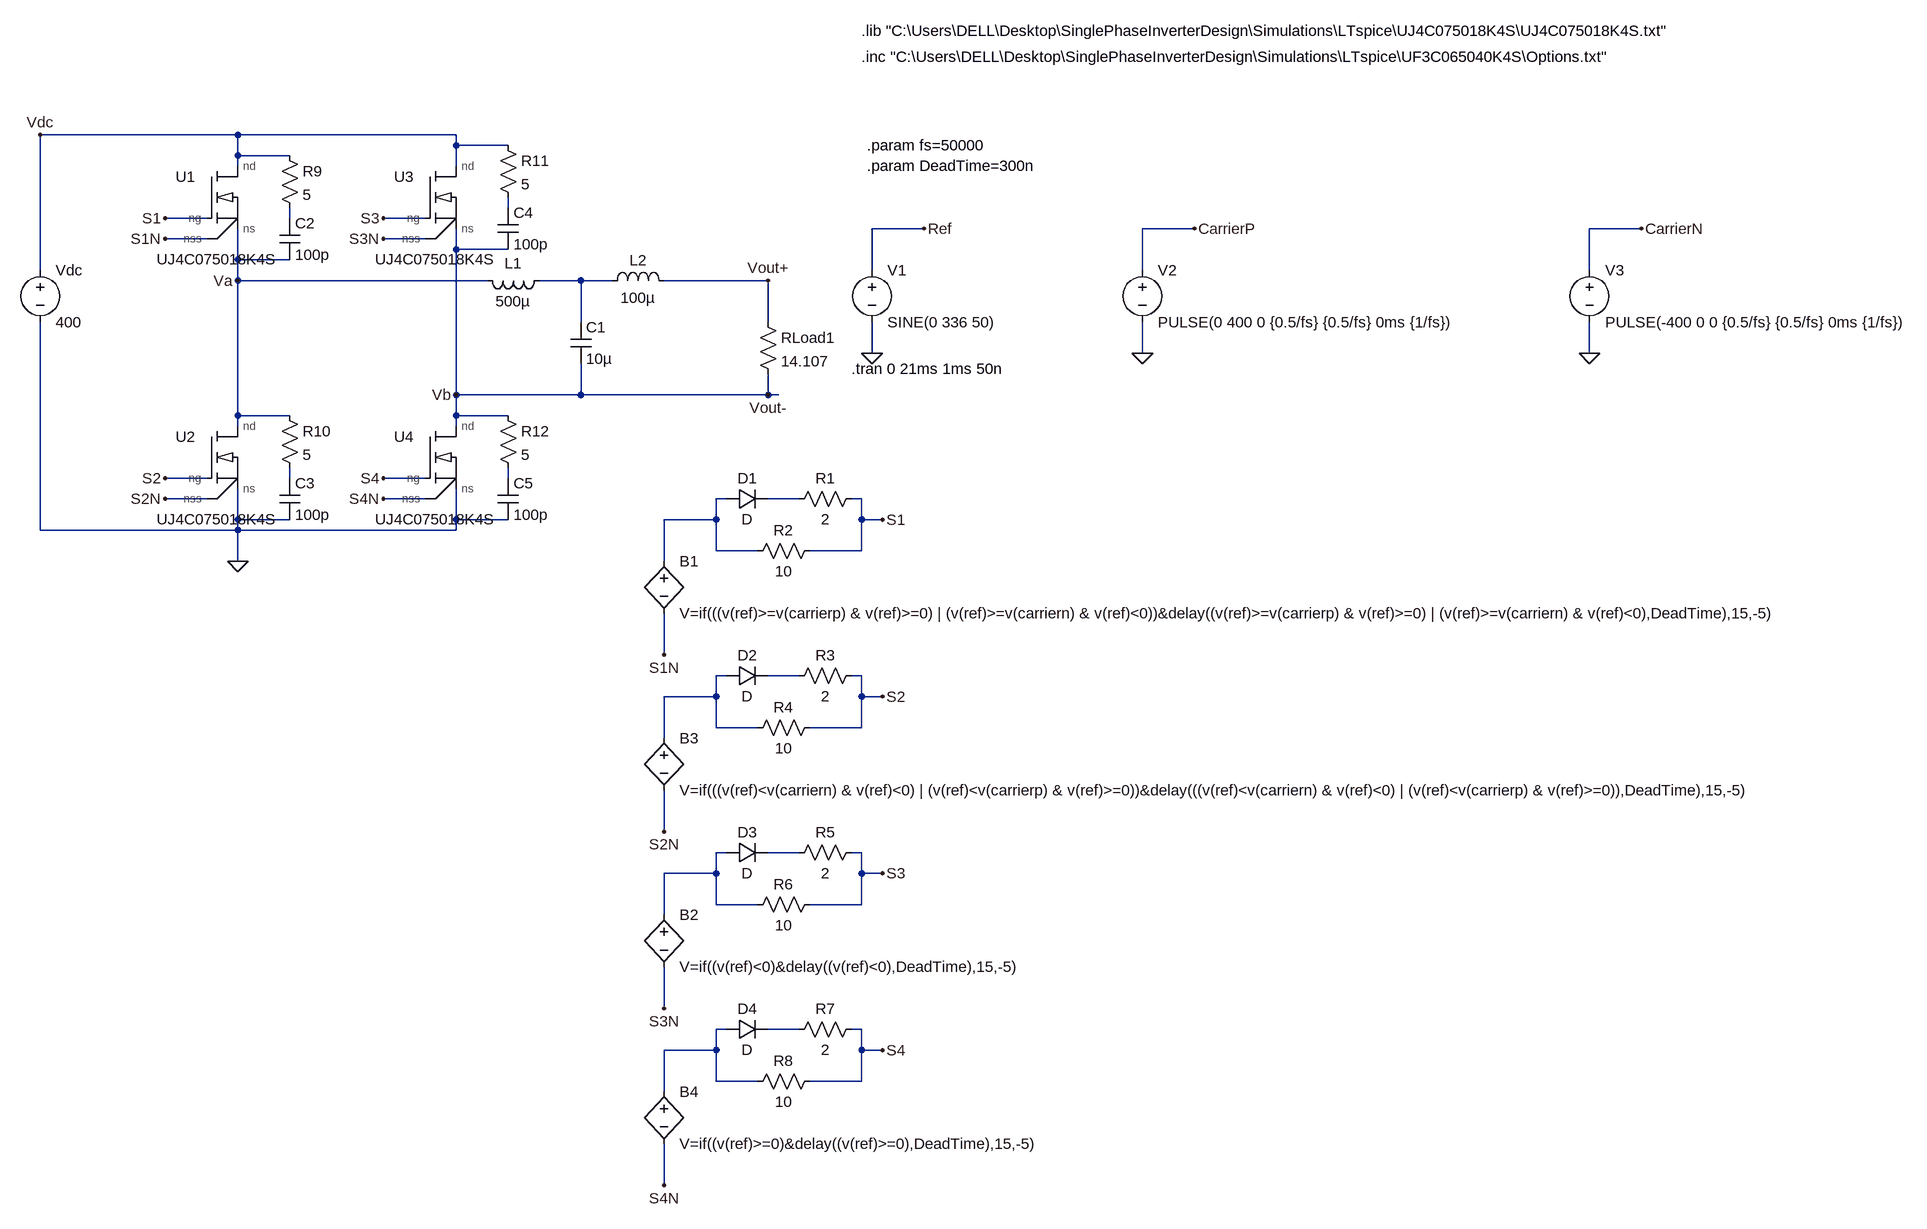
[diagram p0: schematic ModifiedUnipolar_UJ4C075018K4S_DeadTimeLeg.asc]
ModifiedUnipolar_UJ4C075018K4S_DeadTimeLeg.asc, the LTspice schematic file:
Version 4
SHEET 1 2032 1212
WIRE -800 -496 -1104 -496
WIRE -464 -496 -800 -496
WIRE -464 -480 -464 -496
WIRE -384 -480 -464 -480
WIRE -800 -464 -800 -496
WIRE -720 -464 -800 -464
WIRE -800 -448 -800 -464
WIRE -464 -448 -464 -480
WIRE -384 -384 -384 -400
WIRE -848 -368 -912 -368
WIRE -720 -368 -720 -384
WIRE -512 -368 -576 -368
WIRE 256 -352 176 -352
WIRE 672 -352 592 -352
WIRE 1360 -352 1280 -352
WIRE -848 -336 -912 -336
WIRE -512 -336 -576 -336
WIRE -464 -320 -464 -352
WIRE -384 -320 -464 -320
WIRE -800 -304 -800 -352
WIRE -720 -304 -800 -304
WIRE -1104 -288 -1104 -496
WIRE 176 -288 176 -352
WIRE 592 -288 592 -352
WIRE 1280 -288 1280 -352
WIRE -800 -272 -800 -304
WIRE -416 -272 -800 -272
WIRE -272 -272 -336 -272
WIRE -224 -272 -272 -272
WIRE 16 -272 -144 -272
WIRE -272 -208 -272 -272
WIRE 16 -208 16 -272
WIRE 176 -160 176 -208
WIRE 592 -160 592 -208
WIRE 1280 -160 1280 -208
WIRE -464 -96 -464 -320
WIRE -272 -96 -272 -144
WIRE -272 -96 -464 -96
WIRE 16 -96 16 -128
WIRE 16 -96 -272 -96
WIRE 32 -96 16 -96
WIRE -800 -64 -800 -272
WIRE -720 -64 -800 -64
WIRE -464 -64 -464 -96
WIRE -384 -64 -464 -64
WIRE -800 -48 -800 -64
WIRE -464 -48 -464 -64
WIRE -848 32 -912 32
WIRE -720 32 -720 16
WIRE -512 32 -576 32
WIRE -384 32 -384 16
WIRE -848 64 -912 64
WIRE -512 64 -576 64
WIRE -48 64 -64 64
WIRE 64 64 16 64
WIRE 160 64 144 64
WIRE -800 96 -800 48
WIRE -720 96 -800 96
WIRE -464 96 -464 48
WIRE -384 96 -464 96
WIRE -64 96 -64 64
WIRE -64 96 -144 96
WIRE 160 96 160 64
WIRE 192 96 160 96
WIRE -1104 112 -1104 -208
WIRE -800 112 -800 96
WIRE -800 112 -1104 112
WIRE -464 112 -464 96
WIRE -464 112 -800 112
WIRE -64 144 -64 96
WIRE 0 144 -64 144
WIRE 160 144 160 96
WIRE 160 144 80 144
WIRE -800 160 -800 112
WIRE -144 160 -144 96
WIRE -144 304 -144 240
WIRE -48 336 -64 336
WIRE 64 336 16 336
WIRE 160 336 144 336
WIRE -64 368 -64 336
WIRE -64 368 -144 368
WIRE 160 368 160 336
WIRE 192 368 160 368
WIRE -64 416 -64 368
WIRE 0 416 -64 416
WIRE 160 416 160 368
WIRE 160 416 80 416
WIRE -144 432 -144 368
WIRE -144 576 -144 512
WIRE -48 608 -64 608
WIRE 64 608 16 608
WIRE 160 608 144 608
WIRE -64 640 -64 608
WIRE -64 640 -144 640
WIRE 160 640 160 608
WIRE 192 640 160 640
WIRE -64 688 -64 640
WIRE 0 688 -64 688
WIRE 160 688 160 640
WIRE 160 688 80 688
WIRE -144 704 -144 640
WIRE -144 848 -144 784
WIRE -48 880 -64 880
WIRE 64 880 16 880
WIRE 160 880 144 880
WIRE -64 912 -64 880
WIRE -64 912 -144 912
WIRE 160 912 160 880
WIRE 192 912 160 912
WIRE -64 960 -64 912
WIRE 0 960 -64 960
WIRE 160 960 160 912
WIRE 160 960 80 960
WIRE -144 976 -144 912
WIRE -144 1120 -144 1056
FLAG 176 -160 0
FLAG 256 -352 Ref
FLAG 592 -160 0
FLAG 672 -352 CarrierP
FLAG -800 160 0
FLAG 1280 -160 0
FLAG 1360 -352 CarrierN
FLAG 192 96 S1
FLAG 192 368 S2
FLAG 192 640 S3
FLAG 192 912 S4
FLAG -144 304 S1N
FLAG -144 576 S2N
FLAG -144 848 S3N
FLAG -144 1120 S4N
FLAG -912 -368 S1
FLAG -912 32 S2
FLAG -912 -336 S1N
FLAG -912 64 S2N
FLAG -576 -368 S3
FLAG -576 -336 S3N
FLAG -576 32 S4
FLAG -576 64 S4N
FLAG -1104 -496 Vdc
FLAG -800 -272 Va
FLAG -464 -96 Vb
FLAG 16 -272 Vout+
FLAG 16 -96 Vout-
SYMBOL voltage 176 -304 R0
WINDOW 123 0 0 Left 0
WINDOW 39 0 0 Left 0
SYMATTR InstName V1
SYMATTR Value SINE(0 336 50)
SYMBOL voltage 592 -304 R0
WINDOW 123 0 0 Left 0
WINDOW 39 0 0 Left 0
SYMATTR InstName V2
SYMATTR Value PULSE(0 400 0 {0.5/fs} {0.5/fs} 0ms {1/fs})
SYMBOL bv -144 144 R0
SYMATTR InstName B1
SYMATTR Value V=if(((v(ref)>=v(carrierp) & v(ref)>=0) | (v(ref)>=v(carriern) & v(ref)<0))&delay((v(ref)>=v(carrierp) & v(ref)>=0) | (v(ref)>=v(carriern) & v(ref)<0),DeadTime),15,-5)
SYMBOL bv -144 688 R0
SYMATTR InstName B2
SYMATTR Value V=if((v(ref)<0)&delay((v(ref)<0),DeadTime),15,-5)
SYMBOL voltage -1104 -304 R0
WINDOW 123 0 0 Left 0
WINDOW 39 0 0 Left 0
SYMATTR InstName Vdc
SYMATTR Value 400
SYMBOL bv -144 416 R0
SYMATTR InstName B3
SYMATTR Value V=if(((v(ref)<v(carriern) & v(ref)<0) | (v(ref)<v(carrierp) & v(ref)>=0))&delay(((v(ref)<v(carriern) & v(ref)<0) | (v(ref)<v(carrierp) & v(ref)>=0)),DeadTime),15,-5)
SYMBOL bv -144 960 R0
SYMATTR InstName B4
SYMATTR Value V=if((v(ref)>=0)&delay((v(ref)>=0),DeadTime),15,-5)
SYMBOL voltage 1280 -304 R0
WINDOW 123 0 0 Left 0
WINDOW 39 0 0 Left 0
SYMATTR InstName V3
SYMATTR Value PULSE(-400 0 0 {0.5/fs} {0.5/fs} 0ms {1/fs})
SYMBOL res 160 48 R90
WINDOW 0 0 56 VBottom 2
WINDOW 3 32 56 VTop 2
SYMATTR InstName R1
SYMATTR Value 2
SYMBOL diode -48 80 R270
WINDOW 0 32 32 VTop 2
WINDOW 3 0 32 VBottom 2
SYMATTR InstName D1
SYMBOL res 96 128 R90
WINDOW 0 0 56 VBottom 2
WINDOW 3 32 56 VTop 2
SYMATTR InstName R2
SYMATTR Value 10
SYMBOL res 160 320 R90
WINDOW 0 0 56 VBottom 2
WINDOW 3 32 56 VTop 2
SYMATTR InstName R3
SYMATTR Value 2
SYMBOL diode -48 352 R270
WINDOW 0 32 32 VTop 2
WINDOW 3 0 32 VBottom 2
SYMATTR InstName D2
SYMBOL res 96 400 R90
WINDOW 0 0 56 VBottom 2
WINDOW 3 32 56 VTop 2
SYMATTR InstName R4
SYMATTR Value 10
SYMBOL res 160 592 R90
WINDOW 0 0 56 VBottom 2
WINDOW 3 32 56 VTop 2
SYMATTR InstName R5
SYMATTR Value 2
SYMBOL diode -48 624 R270
WINDOW 0 32 32 VTop 2
WINDOW 3 0 32 VBottom 2
SYMATTR InstName D3
SYMBOL res 96 672 R90
WINDOW 0 0 56 VBottom 2
WINDOW 3 32 56 VTop 2
SYMATTR InstName R6
SYMATTR Value 10
SYMBOL res 160 864 R90
WINDOW 0 0 56 VBottom 2
WINDOW 3 32 56 VTop 2
SYMATTR InstName R7
SYMATTR Value 2
SYMBOL diode -48 896 R270
WINDOW 0 32 32 VTop 2
WINDOW 3 0 32 VBottom 2
SYMATTR InstName D4
SYMBOL res 96 944 R90
WINDOW 0 0 56 VBottom 2
WINDOW 3 32 56 VTop 2
SYMATTR InstName R8
SYMATTR Value 10
SYMBOL UF3C065040K4S -832 -400 R0
SYMATTR InstName U1
SYMATTR Value UJ4C075018K4S
SYMBOL UF3C065040K4S -832 0 R0
SYMATTR InstName U2
SYMATTR Value UJ4C075018K4S
SYMBOL UF3C065040K4S -496 -400 R0
SYMATTR InstName U3
SYMATTR Value UJ4C075018K4S
SYMBOL UF3C065040K4S -496 0 R0
SYMATTR InstName U4
SYMATTR Value UJ4C075018K4S
SYMBOL ind -320 -288 R90
WINDOW 0 5 56 VBottom 2
WINDOW 3 32 56 VTop 2
SYMATTR InstName L1
SYMATTR Value 500µ
SYMATTR SpiceLine Rser=30m
SYMBOL res 0 -224 R0
SYMATTR InstName RLoad1
SYMATTR Value 14.107
SYMBOL cap -288 -208 R0
SYMATTR InstName C1
SYMATTR Value 10µ
SYMATTR SpiceLine Rser=0.1m
SYMBOL ind -240 -256 R270
WINDOW 0 32 56 VTop 2
WINDOW 3 5 56 VBottom 2
SYMATTR InstName L2
SYMATTR Value 100µ
SYMBOL res -736 -480 R0
SYMATTR InstName R9
SYMATTR Value 5
SYMBOL cap -736 -368 R0
SYMATTR InstName C2
SYMATTR Value 100p
SYMBOL res -736 -80 R0
SYMATTR InstName R10
SYMATTR Value 5
SYMBOL cap -736 32 R0
SYMATTR InstName C3
SYMATTR Value 100p
SYMBOL res -400 -496 R0
SYMATTR InstName R11
SYMATTR Value 5
SYMBOL cap -400 -384 R0
SYMATTR InstName C4
SYMATTR Value 100p
SYMBOL res -400 -80 R0
SYMATTR InstName R12
SYMATTR Value 5
SYMBOL cap -400 32 R0
SYMATTR InstName C5
SYMATTR Value 100p
TEXT 144 -136 Left 2 !.tran 0 21ms 1ms 50n
TEXT 168 -480 Left 2 !.param fs=50000\n.param DeadTime=300n
TEXT 160 -616 Left 2 !.inc "C:\\Users\\DELL\\Desktop\\SinglePhaseInverterDesign\\Simulations\\LTspice\\UF3C065040K4S\\Options.txt"
TEXT 160 -656 Left 2 !.lib "C:\\Users\\DELL\\Desktop\\SinglePhaseInverterDesign\\Simulations\\LTspice\\UJ4C075018K4S\\UJ4C075018K4S.txt"

The netlist it stands for:
* ModifiedUnipolar_UJ4C075018K4S_DeadTimeLeg.asc
V1 Ref 0 SINE(0 336 50)
V2 CarrierP 0 PULSE(0 400 0 {0.5/fs} {0.5/fs} 0ms {1/fs})
B1 N006 S1N V=if(((v(ref)>=v(carrierp) & v(ref)>=0) | (v(ref)>=v(carriern) & v(ref)<0))&delay((v(ref)>=v(carrierp) & v(ref)>=0) | (v(ref)>=v(carriern) & v(ref)<0),DeadTime),15,-5)
B2 N010 S3N V=if((v(ref)<0)&delay((v(ref)<0),DeadTime),15,-5)
Vdc Vdc 0 400
B3 N008 S2N V=if(((v(ref)<v(carriern) & v(ref)<0) | (v(ref)<v(carrierp) & v(ref)>=0))&delay(((v(ref)<v(carriern) & v(ref)<0) | (v(ref)<v(carrierp) & v(ref)>=0)),DeadTime),15,-5)
B4 N012 S4N V=if((v(ref)>=0)&delay((v(ref)>=0),DeadTime),15,-5)
V3 CarrierN 0 PULSE(-400 0 0 {0.5/fs} {0.5/fs} 0ms {1/fs})
R1 S1 N007 2
D1 N006 N007 D
R2 S1 N006 10
R3 S2 N009 2
D2 N008 N009 D
R4 S2 N008 10
R5 S3 N011 2
D3 N010 N011 D
R6 S3 N010 10
R7 S4 N013 2
D4 N012 N013 D
R8 S4 N012 10
XU1 Vdc S1 Va S1N UJ4C075018K4S  ; pins nd ng ns nss
XU2 Va S2 0 S2N UJ4C075018K4S  ; pins nd ng ns nss
XU3 Vdc S3 Vout- S3N UJ4C075018K4S  ; pins nd ng ns nss
XU4 Vout- S4 0 S4N UJ4C075018K4S  ; pins nd ng ns nss
L1 N003 Va 500µ Rser=30m
RLoad1 Vout+ Vout- 14.107
C1 N003 Vout- 10µ Rser=0.1m
L2 N003 Vout+ 100µ
R9 Vdc N002 5
C2 N002 Va 100p
R10 Va N004 5
C3 N004 0 100p
R11 Vdc N001 5
C4 N001 Vout- 100p
R12 Vout- N005 5
C5 N005 0 100p
.model D D
.lib standard.dio
.tran 0 21ms 1ms 50n
.param fs=50000
.param DeadTime=300n
.inc "C:\Users\DELL\Desktop\SinglePhaseInverterDesign\Simulations\LTspice\UF3C065040K4S\Options.txt"
.lib "C:\Users\DELL\Desktop\SinglePhaseInverterDesign\Simulations\LTspice\UJ4C075018K4S\UJ4C075018K4S.txt"
.lib C:\Users\ycay\Desktop\FullBridge_Modulations\Transformless_SP_Inverter\FullBridge_LTspice\UF3C065040K4S\UF3C065040K4S.txt
.backanno
.end